# Altium schematic sheet NRF52840.SchDoc
size 431 x 279 mm; SheetNumber: 1; SheetTotal: 2; ENG_APP_DATE: --/--/--; DSN_APP_DATE: --/--/--; CHK_APP_DATE: --/--/--
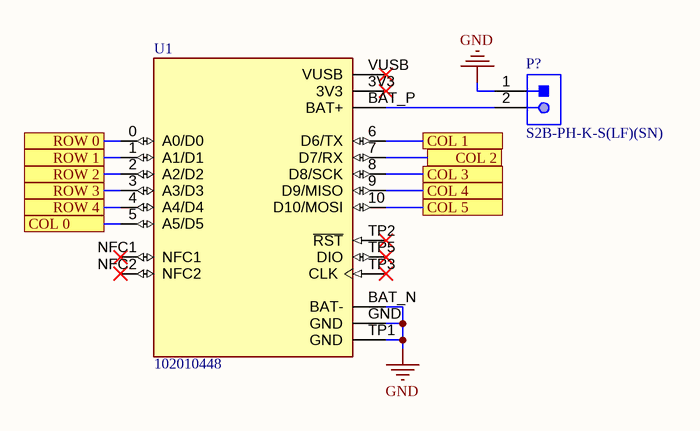
[diagram p0: NRF52840.SchDoc]

## Parts
P?  S2B-PH-K-S(LF)(SN)  [JST-S2B-PH-K-S_V]
U1  102010448  [MODULE_102010448]

## Ports
COL 0, COL 1, COL 2, COL 3, COL 4, COL 5, ROW 0, ROW 1, ROW 2, ROW 3, ROW 4

## Nets
GND: P?.1 U1.BAT_N(BAT-) U1.GND U1.TP1(GND)
COL 0: U1.5(A5/D5) ; port COL 0
COL 1: U1.6(D6/TX) ; port COL 1
COL 2: U1.7(D7/RX) ; port COL 2
COL 3: U1.8(D8/SCK) ; port COL 3
COL 4: U1.9(D9/MISO) ; port COL 4
COL 5: U1.10(D10/MOSI) ; port COL 5
ROW 0: U1.0(A0/D0) ; port ROW 0
ROW 1: U1.1(A1/D1) ; port ROW 1
ROW 2: U1.2(A2/D2) ; port ROW 2
ROW 3: U1.3(A3/D3) ; port ROW 3
ROW 4: U1.4(A4/D4) ; port ROW 4
NetP?_2: P?.2 U1.BAT_P(BAT+)

Not connected (* = marked no-connect by the designer): U1 3V3* NFC1* NFC2* TP2(~{RST})* TP3(CLK)* TP5(DIO)* VUSB*

## Notes on the sheet
- DWG. NO.
- REV.
- SHT.
- THIS DOCUMENT AND THE DATA DISCLOSED HEREIN OR HEREWITH IS THE PROPERTY OF ALTIUM LIMITED AND MAY BE FREELY DISTRIBUTED IN WHOLE. NO RIGHTS ARE RESERVED OR EXPRESS OR IMPLIED WARANTEE GIVEN.
- REVISION
- DESCRIPTION
- DATE
- APPROVED
- ENG:
- APPROVALS
- PROJECT
- DSN:
- CHK:
- REFERENCE DOCUMENTS
- PROJECT REVISION:
- TITLE
- DOCUMENT REVISION:
- DESIGN ITEM:
- BOM:
- FAB DWG:
- PCB DWG:
- ASSY DWG:
- SCALE:
- SIZE
- B
- CAGE CODE
- FILE NAME
- DWG NO.
- SHEET
- OF
- REV

## Library data of the parts
P? = CMP-1755-00004-1: Male Header, Pitch 2 mm, 1 x 2 Position, Height 4.8 mm, Tail Length 3.4 mm, -25 to 85 degC, RoHS, Bulk; Case\Package: Radial; Tolerance: 20%; Capacitance: 10 uF; Voltage Rating (DC): 50 V; Packaging: Bulk; ComponentLink1URL: http://www.jst-mfg.com/product/pdf/eng/ePH.pdf; Radiation Hardening: No; Height: 11 mm; Package Quantity: 200; PackageDescription: Male Header, Pitch 2 mm, 1 x 2 Position, Height 4.8 mm, Tail Length 3.4 mm; PackageReference: S2B-PH-K-S; Diameter: 5 mm; Pins: 2; Mount: Through Hole; Max Operating Temperature: 85 degC; Min Operating Temperature: -40 degC; ComponentLink1Description: Datasheet; DatasheetVersion: Dec-12; Length: 11 mm; Lead Pitch: 2 mm; REACH SVHC: No SVHC; Voltage Rating: 50 V; RoHSCompliant: true
U1 = 102010448: - nRF52840 Transceiver; Bluetooth® 5.x Evaluation Board; MF: Seeed Technology Co., Ltd; SnapEDA_Link: https://www.snapeda.com/parts/102010448/Seeed+Technology+Co.%252C+Ltd/view-part/?ref=snap; Package: None; Value: *; MP: 102010448; Check_prices: https://www.snapeda.com/parts/102010448/Seeed+Technology+Co.%252C+Ltd/view-part/?ref=eda